# Altium schematic sheet UART_CONTROL.SchDoc
size A4; SheetNumber: 5; SheetTotal: 5
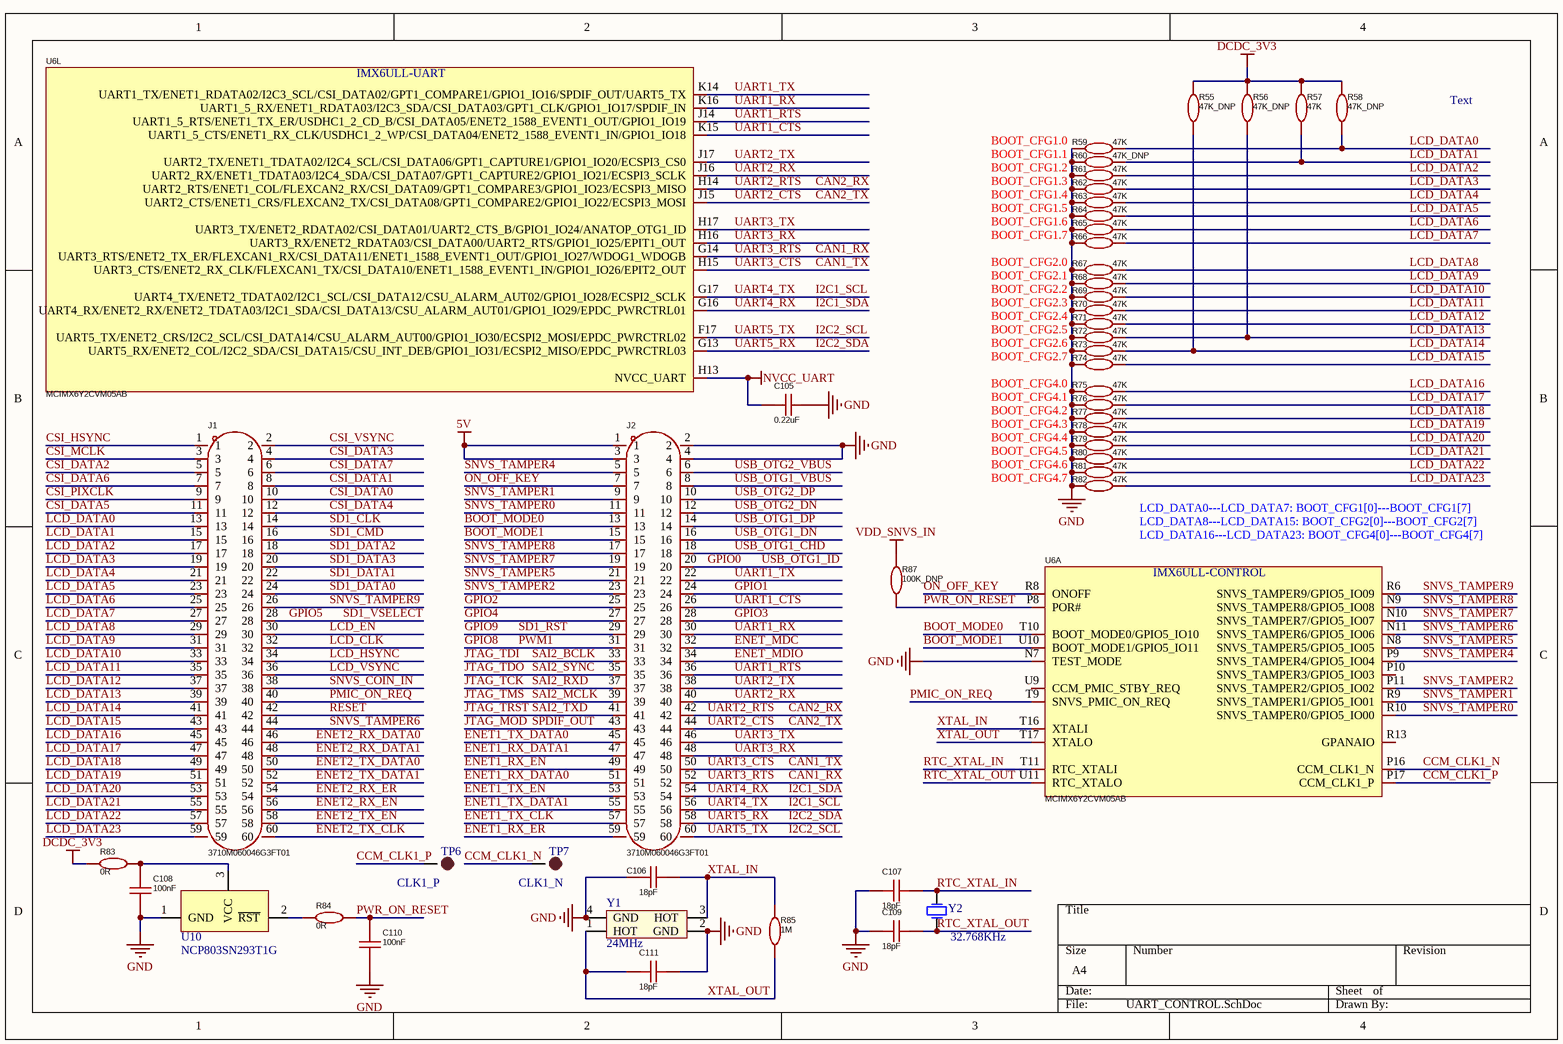
[diagram p0: UART_CONTROL.SchDoc]

## Parts
C105  0.22uF  [C0402]
C106  18pF  [C0402]
C107  18pF  [C0402]
C108  100nF  [C0402]
C109  18pF  [C0402]
C110  100nF  [C0402]
C111  18pF  [C0402]
J1  3710M060046G3FT01  [CONN-SMD_60P-P0.80_3710M060046G3FT01]
J2  3710M060046G3FT01  [CONN-SMD_60P-P0.80_3710M060046G3FT01]
R55  47K_DNP  [R0402]
R56  47K_DNP  [R0402]
R57  47K  [R0402]
R58  47K_DNP  [R0402]
R59  47K  [R0402]
R60  47K_DNP  [R0402]
R61  47K  [R0402]
R62  47K  [R0402]
R63  47K  [R0402]
R64  47K  [R0402]
R65  47K  [R0402]
R66  47K  [R0402]
R67  47K  [R0402]
R68  47K  [R0402]
R69  47K  [R0402]
R70  47K  [R0402]
R71  47K  [R0402]
R72  47K  [R0402]
R73  47K  [R0402]
R74  47K  [R0402]
R75  47K  [R0402]
R76  47K  [R0402]
R77  47K  [R0402]
R78  47K  [R0402]
R79  47K  [R0402]
R80  47K  [R0402]
R81  47K  [R0402]
R82  47K  [R0402]
R83  0R  [R0402]
R84  0R  [R0402]
R85  1M  [R0402]
R87  100K_DNP  [R0402]
TP6  CLK1_P  [TP-1.0]
TP7  CLK1_N  [TP-1.0]
U6  MCIMX6Y2CVM05AB  [BGA-289_L14.0-W14.0-R17-C17-P0.80-BL]  (parts A,L of 12)
U10  NCP803SN293T1G  [SOT23-3L]
Y1  24MHz  [XTAL-3225]
Y2  32.768KHz  [XTAL-3215]

## Nets
5V: J2.1 J2.3
DCDC_3V3: R55.2 R56.2 R57.2 R58.2 R83.1
GND: C105.1 C106.2 C107.2 C108.1 C109.2 C110.1 C111.1 J2.2 J2.4 R59.1 R60.1 R61.1 R62.1 R63.1 R64.1 R65.1 R66.1 R67.1 R68.1 R69.1 R70.1 R71.1 R72.1 R73.1 R74.1 R75.1 R76.1 R77.1 R78.1 R79.1 R80.1 R81.1 R82.1 U6.N7(TEST_MODE) U10.1(GND) Y1.2(GND) Y1.4(GND)
NVCC_UART: C105.2 U6.H13(NVCC_UART)
VDD_SNVS_IN: R87.2
BOOT_MODE0: J2.13 U6.T10(BOOT_MODE0/GPIO5_IO10)
BOOT_MODE1: J2.15 U6.U10(BOOT_MODE1/GPIO5_IO11)
CAN1_RX: J2.52 U6.G14(UART3_RTS/ENET2_TX_ER/FLEXCAN1_RX/CSI_DATA11/ENET1_1588_EVENT1_OUT/GPIO1_IO27/WDOG1_WDOGB)  [also labelled UART3_RTS]
CAN1_TX: J2.50 U6.H15(UART3_CTS/ENET2_RX_CLK/FLEXCAN1_TX/CSI_DATA10/ENET1_1588_EVENT1_IN/GPIO1_IO26/EPIT2_OUT)  [also labelled UART3_CTS]
CAN2_RX: J2.42 U6.H14(UART2_RTS/ENET1_COL/FLEXCAN2_RX/CSI_DATA09/GPT1_COMPARE3/GPIO1_IO23/ECSPI3_MISO)  [also labelled UART2_RTS]
CAN2_TX: J2.44 U6.J15(UART2_CTS/ENET1_CRS/FLEXCAN2_TX/CSI_DATA08/GPT1_COMPARE2/GPIO1_IO22/ECSPI3_MOSI)  [also labelled UART2_CTS]
CCM_CLK1_N: TP7.1 U6.P16(CCM_CLK1_N)
CCM_CLK1_P: TP6.1 U6.P17(CCM_CLK1_P)
CSI_DATA0: J1.10
CSI_DATA1: J1.8
CSI_DATA2: J1.5
CSI_DATA3: J1.4
CSI_DATA4: J1.12
CSI_DATA5: J1.11
CSI_DATA6: J1.7
CSI_DATA7: J1.6
CSI_HSYNC: J1.1
CSI_MCLK: J1.3
CSI_PIXCLK: J1.9
CSI_VSYNC: J1.2
ENET1_RX_DATA0: J2.51
ENET1_RX_DATA1: J2.47
ENET1_RX_EN: J2.49
ENET1_RX_ER: J2.59
ENET1_TX_CLK: J2.57
ENET1_TX_DATA0: J2.45
ENET1_TX_DATA1: J2.55
ENET1_TX_EN: J2.53
ENET2_RX_DATA0: J1.46
ENET2_RX_DATA1: J1.48
ENET2_RX_EN: J1.56
ENET2_RX_ER: J1.54
ENET2_TX_CLK: J1.60
ENET2_TX_DATA0: J1.50
ENET2_TX_DATA1: J1.52
ENET2_TX_EN: J1.58
ENET_MDC: J2.32
ENET_MDIO: J2.34
GPIO0: J2.20  [also labelled USB_OTG1_ID]
GPIO1: J2.24
GPIO2: J2.25
GPIO3: J2.28
GPIO4: J2.27
GPIO5: J1.28  [also labelled SD1_VSELECT]
GPIO8: J2.31  [also labelled PWM1]
GPIO9: J2.29  [also labelled SD1_RST]
I2C1_SCL: J2.56 U6.G17(UART4_TX/ENET2_TDATA02/I2C1_SCL/CSI_DATA12/CSU_ALARM_AUT02/GPIO1_IO28/ECSPI2_SCLK)  [also labelled UART4_TX]
I2C1_SDA: J2.54 U6.G16(UART4_RX/ENET2_RX/ENET2_TDATA03/I2C1_SDA/CSI_DATA13/CSU_ALARM_AUT01/GPIO1_IO29/EPDC_PWRCTRL01)  [also labelled UART4_RX]
I2C2_SCL: J2.60 U6.F17(UART5_TX/ENET2_CRS/I2C2_SCL/CSI_DATA14/CSU_ALARM_AUT00/GPIO1_IO30/ECSPI2_MOSI/EPDC_PWRCTRL02)  [also labelled UART5_TX]
I2C2_SDA: J2.58 U6.G13(UART5_RX/ENET2_COL/I2C2_SDA/CSI_DATA15/CSU_INT_DEB/GPIO1_IO31/ECSPI2_MISO/EPDC_PWRCTRL03)  [also labelled UART5_RX]
JTAG_MOD: J2.43  [also labelled SPDIF_OUT]
JTAG_TCK: J2.37  [also labelled SAI2_RXD]
JTAG_TDI: J2.33  [also labelled SAI2_BCLK]
JTAG_TDO: J2.35  [also labelled SAI2_SYNC]
JTAG_TMS: J2.39  [also labelled SAI2_MCLK]
JTAG_TRST: J2.41  [also labelled SAI2_TXD]
LCD_CLK: J1.32
LCD_DATA0: J1.13 R58.1 R59.2
LCD_DATA1: J1.15 R57.1 R60.2
LCD_DATA2: J1.17 R61.2
LCD_DATA3: J1.19 R62.2
LCD_DATA4: J1.21 R63.2
LCD_DATA5: J1.23 R64.2
LCD_DATA6: J1.25 R65.2
LCD_DATA7: J1.27 R66.2
LCD_DATA8: J1.29 R67.2
LCD_DATA9: J1.31 R68.2
LCD_DATA10: J1.33 R69.2
LCD_DATA11: J1.35 R70.2
LCD_DATA12: J1.37 R71.2
LCD_DATA13: J1.39 R56.1 R72.2
LCD_DATA14: J1.41 R55.1 R73.2
LCD_DATA15: J1.43 R74.2
LCD_DATA16: J1.45 R75.2
LCD_DATA17: J1.47 R76.2
LCD_DATA18: J1.49 R77.2
LCD_DATA19: J1.51 R78.2
LCD_DATA20: J1.53 R79.2
LCD_DATA21: J1.55 R80.2
LCD_DATA22: J1.57 R81.2
LCD_DATA23: J1.59 R82.2
LCD_EN: J1.30
LCD_HSYNC: J1.34
LCD_VSYNC: J1.36
ON_OFF_KEY: J2.7 U6.R8(ONOFF)
PMIC_ON_REQ: J1.40 U6.T9(SNVS_PMIC_ON_REQ)
PWR_ON_RESET: C110.2 R84.2 R87.1 U6.P8(POR#)
RESET: J1.42
RTC_XTAL_IN: C107.1 U6.T11(RTC_XTALI) Y2.2(OSC2)
RTC_XTAL_OUT: C109.1 U6.U11(RTC_XTALO) Y2.1(OSC1)
SD1_CLK: J1.14
SD1_CMD: J1.16
SD1_DATA0: J1.24
SD1_DATA1: J1.22
SD1_DATA2: J1.18
SD1_DATA3: J1.20
SNVS_COIN_IN: J1.38
SNVS_TAMPER0: J2.11 U6.R10(SNVS_TAMPER0/GPIO5_IO00)
SNVS_TAMPER1: J2.9 U6.R9(SNVS_TAMPER1/GPIO5_IO01)
SNVS_TAMPER2: J2.23 U6.P11(SNVS_TAMPER2/GPIO5_IO02)
SNVS_TAMPER4: J2.5 U6.P9(SNVS_TAMPER4/GPIO5_IO04)
SNVS_TAMPER5: J2.21 U6.N8(SNVS_TAMPER5/GPIO5_IO05)
SNVS_TAMPER6: J1.44 U6.N11(SNVS_TAMPER6/GPIO5_IO06)
SNVS_TAMPER7: J2.19 U6.N10(SNVS_TAMPER7/GPIO5_IO07)
SNVS_TAMPER8: J2.17 U6.N9(SNVS_TAMPER8/GPIO5_IO08)
SNVS_TAMPER9: J1.26 U6.R6(SNVS_TAMPER9/GPIO5_IO09)
UART1_CTS: J2.26 U6.K15(UART1_5_CTS/ENET1_RX_CLK/USDHC1_2_WP/CSI_DATA04/ENET2_1588_EVENT1_IN/GPIO1_IO18)
UART1_RTS: J2.36 U6.J14(UART1_5_RTS/ENET1_TX_ER/USDHC1_2_CD_B/CSI_DATA05/ENET2_1588_EVENT1_OUT/GPIO1_IO19)
UART1_RX: J2.30 U6.K16(UART1_5_RX/ENET1_RDATA03/I2C3_SDA/CSI_DATA03/GPT1_CLK/GPIO1_IO17/SPDIF_IN)
UART1_TX: J2.22 U6.K14(UART1_TX/ENET1_RDATA02/I2C3_SCL/CSI_DATA02/GPT1_COMPARE1/GPIO1_IO16/SPDIF_OUT/UART5_TX)
UART2_RX: J2.40 U6.J16(UART2_RX/ENET1_TDATA03/I2C4_SDA/CSI_DATA07/GPT1_CAPTURE2/GPIO1_IO21/ECSPI3_SCLK)
UART2_TX: J2.38 U6.J17(UART2_TX/ENET1_TDATA02/I2C4_SCL/CSI_DATA06/GPT1_CAPTURE1/GPIO1_IO20/ECSPI3_CS0)
UART3_RX: J2.48 U6.H16(UART3_RX/ENET2_RDATA03/CSI_DATA00/UART2_RTS/GPIO1_IO25/EPIT1_OUT)
UART3_TX: J2.46 U6.H17(UART3_TX/ENET2_RDATA02/CSI_DATA01/UART2_CTS_B/GPIO1_IO24/ANATOP_OTG1_ID)
USB_OTG1_CHD: J2.18
USB_OTG1_DN: J2.16
USB_OTG1_DP: J2.14
USB_OTG1_VBUS: J2.8
USB_OTG2_DN: J2.12
USB_OTG2_DP: J2.10
USB_OTG2_VBUS: J2.6
XTAL_IN: C106.1 R85.2 U6.T16(XTALI) Y1.3(HOT)
XTAL_OUT: C111.2 R85.1 U6.T17(XTALO) Y1.1(HOT)
NetC108_2: C108.2 R83.2 U10.3(VCC)
NetR84_1: R84.1 U10.2(~{RST})

Not connected (* = marked no-connect by the designer): U6 P10(SNVS_TAMPER3/GPIO5_IO03) R13(GPANAIO) U9(CCM_PMIC_STBY_REQ)

## Notes on the sheet
- Text
- BOOT_CFG1.0
- BOOT_CFG1.1
- BOOT_CFG1.2
- BOOT_CFG1.3
- BOOT_CFG1.4
- BOOT_CFG1.5
- BOOT_CFG1.6
- BOOT_CFG1.7
- BOOT_CFG2.0
- BOOT_CFG2.1
- BOOT_CFG2.2
- BOOT_CFG2.3
- BOOT_CFG2.4
- BOOT_CFG2.5
- BOOT_CFG2.6
- BOOT_CFG2.7
- BOOT_CFG4.0
- BOOT_CFG4.1
- BOOT_CFG4.2
- BOOT_CFG4.3
- BOOT_CFG4.4
- BOOT_CFG4.5
- BOOT_CFG4.6
- BOOT_CFG4.7
- LCD_DATA0---LCD_DATA7: BOOT_CFG1[0]---BOOT_CFG1[7]
  LCD_DATA8---LCD_DATA15: BOOT_CFG2[0]---BOOT_CFG2[7]
  LCD_DATA16---LCD_DATA23: BOOT_CFG4[0]---BOOT_CFG4[7]
- (in symbol MCIMX6Y2CVM05AB, part A) IMX6ULL-CONTROL
- (in symbol MCIMX6Y2CVM05AB, part L) IMX6ULL-UART

## Library data of the parts
C105-C107 C109 C111 = C0402: 容值:100nF;精度:±10%;额定电压:50V;材质(温度系数):X7R;; Manufacturer: muRata(村田); Symbol: GRM155R71H104KE14D; Add into BOM: yes; Value: 100nF; Tolerance: ±10%; Voltage Rated: 50V; Temperature Coefficient: X7R; Device: GRM155R71H104KE14D; LCSC Part Name: 100nF ±10% 50V; Supplier Part: C77020; Manufacturer Part: GRM155R71H104KE14D; Supplier Footprint: 0402; JLCPCB Part Class: 扩展库; Datasheet: https://atta.szlcsc.com/upload/public/pdf/source/20180326/C77020_39BD49C951FF1AF0DB1F1FAC5AC1E401.pdf; Supplier: LCSC; Convert to PCB: yes
C108 C110 = C0402: 容值:100nF;精度:±10%;额定电压:50V;材质(温度系数):X7R;; Manufacturer: muRata(村田); Symbol: GRM155R71H104KE14D; Add into BOM: yes; Tolerance: ±10%; Voltage Rated: 50V; Temperature Coefficient: X7R; Device: GRM155R71H104KE14D; LCSC Part Name: 100nF ±10% 50V; Supplier Part: C77020; Manufacturer Part: GRM155R71H104KE14D; Supplier Footprint: 0402; JLCPCB Part Class: 扩展库; Datasheet: https://atta.szlcsc.com/upload/public/pdf/source/20180326/C77020_39BD49C951FF1AF0DB1F1FAC5AC1E401.pdf; Supplier: LCSC; Convert to PCB: yes; Value: 100nF
J1 J2 = 3710M060046G3FT01: Add into BOM: yes; Symbol: 3710M060046G3FT01; Device: 3710M060046G3FT01; LCSC Part Name: 3710M060046G3FT01; Supplier Part: C9900016341; Manufacturer Part: 3710M060046G3FT01; Supplier Footprint: SMD-60; JLCPCB Part Class: 扩展库; Supplier: LCSC; Convert to PCB: yes
R55-R85 R87 = R0402: 电阻类型:厚膜电阻;阻值:1kΩ;精度:±1%;功率:62.5mW;最大工作电压:50V;温度系数:±100ppm/℃;; Manufacturer: UNI-ROYAL(厚声); Symbol: 0402WGF1001TCE; Add into BOM: yes; Value: 1kΩ; Tolerance: ±1%; Power(Watts): 62.5mW; Overload Voltage (Max): 50V; Device: 0402WGF1001TCE; LCSC Part Name: 1kΩ ±1% 62.5mW 厚膜电阻; Supplier Part: C11702; Manufacturer Part: 0402WGF1001TCE; Supplier Footprint: 0402; JLCPCB Part Class: 基础库; Datasheet: https://atta.szlcsc.com/upload/public/pdf/source/20200306/C422600_1E6D84923E4A46A82E41ADD87F860B5C.pdf; Supplier: LCSC; Convert to PCB: yes; Type: 厚膜电阻; Temperature Coefficient: ±100ppm/℃; Operating Temperature Range: -55℃~+155℃
TP6 TP7 = TEST-POINT: 测试点
U6 = MCIMX6Y2CVM05AB: CPU内核:ARM-A系列;RAM总容量:128KB;GPIO端口数量:-;工作电压范围:-;CPU最大主频:528MHz;程序存储器类型:-;应用领域:-;; Manufacturer: NXP(恩智浦); Add into BOM: yes; RAM Size: 128KB; CPU Maximum Speed: 528MHz; ADC (Bit): 12bit; UART/USART: 8; I2C: 4; Universal Serial Bus: 有; Peripheral/Function: 真随机数发生器; Symbol: MCIMX6Y2CVM05AB; Device: MCIMX6Y2CVM05AB; LCSC Part Name: MCIMX6Y2CVM05AB; Supplier Part: C394783; Manufacturer Part: MCIMX6Y2CVM05AB; Supplier Footprint: MAPBGA-289(14x14); JLCPCB Part Class: 扩展库; Datasheet: https://atta.szlcsc.com/upload/public/pdf/source/20190903/C414057_F91A491E37DFDD32A6FE61E7D0CA74B1.pdf; Supplier: LCSC; Convert to PCB: yes; CPU Core: ARM-A系列; GPIO Ports Number: -; Operating Voltage Range: -; Program Memory Type: -; Operating Temperature Range: -40℃~+105℃; DAC (Bit): -; PWM (Bit): -; 8Bit Timer: -; 16Bit Timer: -; 32Bit Timer: -; CAN: -; I2S: -; SPI: 4; Internal Comparator: -; communication protocol: -; Watchdog: -; Real-Time Clock: -; Infrared Data Association: -; Low-Voltage Detect: -; CCP Capture/Compare: -; LCD Module: 有; LED Module: -; Secure Digital Input and Output: -; Direct Memory Access: -; Internal Oscillator: -; Application Area: -
Y1 = XTAL_3225: 3225贴片无源晶振
Y2 = XTAL: 普通晶振; Published: 8-Jun-2000; LatestRevisionDate: 17-Jul-2002; LatestRevisionNote: Re-released for DXP Platform.; Publisher: Altium Limited